# EAGLE design primero (EAGLE 9.6.2)
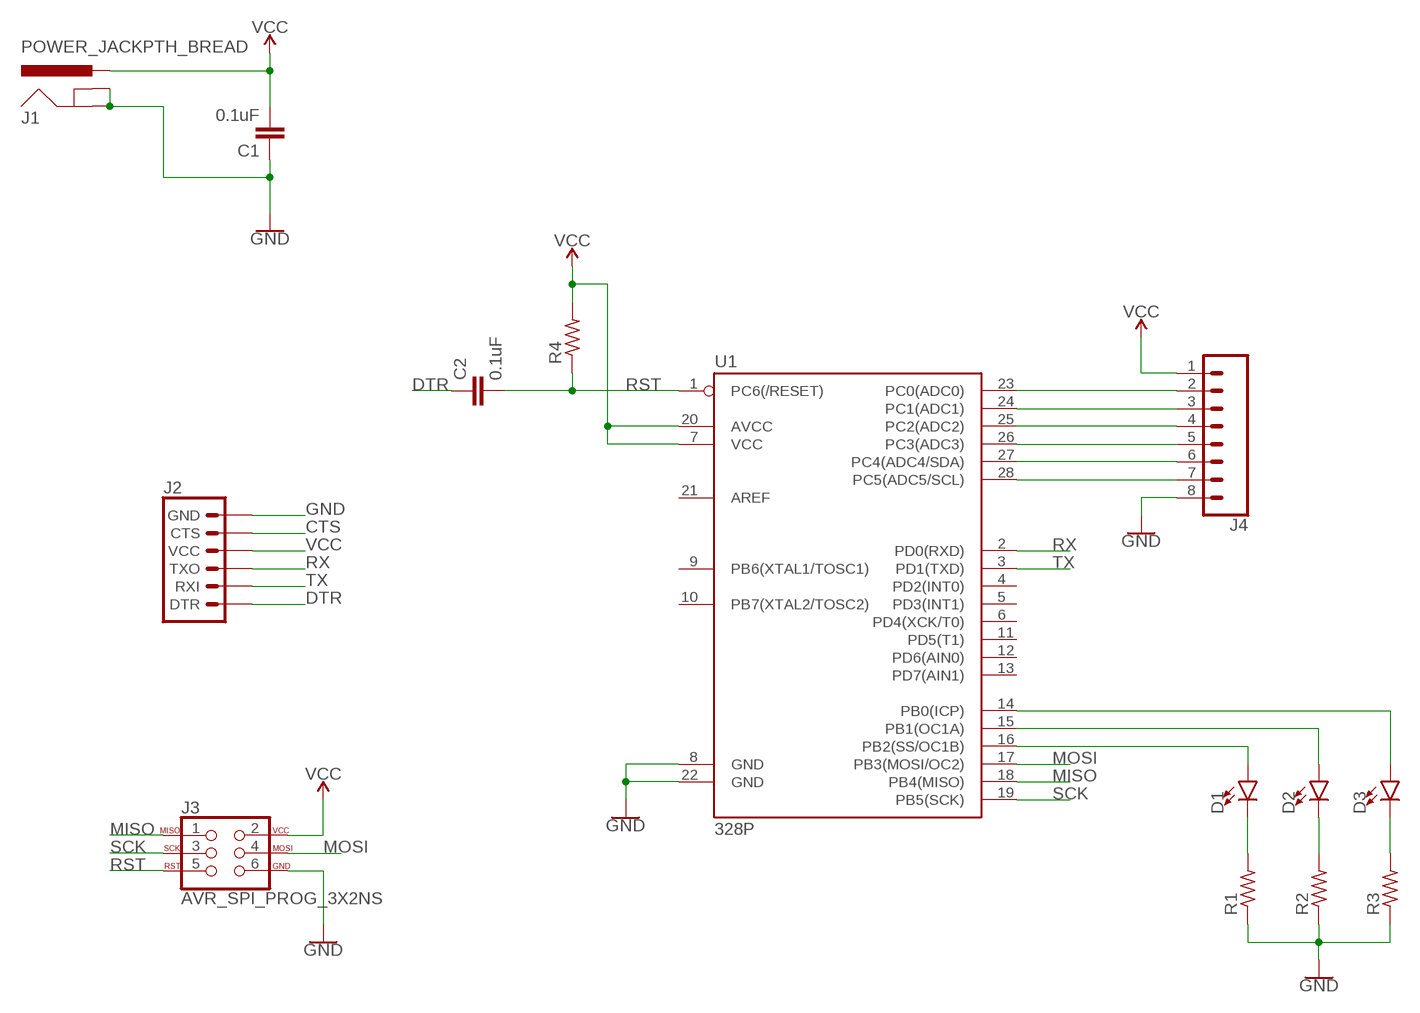
[diagram p0: schematic, sheet 1]

## Parts
C1  0.1uF  0.1UF-KIT-EZ-50V-20%  [CAP-PTH-SMALL-KIT]
C2  0.1uF  0.1UF-KIT-EZ-50V-20%  [CAP-PTH-SMALL-KIT]
D1  LED5MM  [LED_5MM]
D2  LED5MM  [LED_5MM]
D3  LED5MM  [LED_5MM]
J1  POWER_JACKPTH_BREAD  [POWER_JACK_PTH_BREAD]
J2  6_PIN_SERIAL_TARGET  [1X06]
J3  AVR_SPI_PROG_3X2NS  [2X3-NS]
J4  CONN_08"  [1X08]
R1  R-US_0204/5  [0204/5]
R2  R-US_0204/5  [0204/5]
R3  R-US_0204/5  [0204/5]
R4  R-US_0204/5  [0204/5]
U1  328P  ATMEGA328P_PDIP  [DIP28]

## Nets
CTS: J2.5(CTS)
DTR: C2.1 J2.1(DTR)
GND: C1.1 J1.GND J1.GNDBREAK J2.6(GND) J3.6 J4.8 R1.1 R2.1 R3.1 U1.8(GND) U1.22(GND)
MISO: J3.1 U1.18(PB4(MISO))
MOSI: J3.4 U1.17(PB3(MOSI/OC2))
N$2: J4.2 U1.23(PC0(ADC0))
N$3: J4.3 U1.24(PC1(ADC1))
N$4: J4.4 U1.25(PC2(ADC2))
N$5: J4.5 U1.26(PC3(ADC3))
N$6: J4.6 U1.27(PC4(ADC4/SDA))
N$7: J4.7 U1.28(PC5(ADC5/SCL))
N$8: D3.A U1.14(PB0(ICP))
N$9: D3.K(C) R3.2
N$10: D2.K(C) R2.2
N$11: D1.K(C) R1.2
N$12: D2.A U1.15(PB1(OC1A))
N$13: D1.A U1.16(PB2(SS/OC1B))
RST: C2.2 J3.5 R4.1 U1.1(PC6(/RESET))
RX: J2.3(TXO) U1.2(PD0(RXD))
SCK: J3.3 U1.19(PB5(SCK))
TX: J2.2(RXI) U1.3(PD1(TXD))
VCC: C1.2 J1.PWR J2.4(VCC) J3.2 J4.1 R4.2 U1.7(VCC) U1.20(AVCC)
Unconnected: U1.4(PD2(INT0)) U1.5(PD3(INT1)) U1.6(PD4(XCK/T0)) U1.9(PB6(XTAL1/TOSC1)) U1.10(PB7(XTAL2/TOSC2)) U1.11(PD5(T1)) U1.12(PD6(AIN0)) U1.13(PD7(AIN1)) U1.21(AREF)

## Library data of the parts
C1 C2 = SparkFun-Capacitors:0.1UF: 0.1µF ceramic capacitors A capacitor is a passive two-terminal electrical component used to store electrical energy temporarily in an electric field.; PROD_ID: CAP-08370
D1-D3 = SparkFun-LED:LED: LED (Generic) Standard schematic elements and footprints for 5mm, 3mm, 1206, and 0603 sized LEDs. Generic LEDs with no color specified.
J1 = SparkFun-Connectors:POWER_JACK: Power Jack Connector This is the standard 5.5mm barrel jack for power. The PTH is the most common, proven, reliable, footprint. The Slot footprint only works if the mill layer is transmitted to the PCB fab house so be warned. Here are the connectors we sell at SparkFun: DC Barrel Power Jack/Connector <https://www.sparkfun.com/products/119> (PRT-00119) DC Barrel Power Jack/Connector (SMD) <https://www.sparkfun.com/products/12748> (PRT-12748) DC Barrel Jack Adapter - Breadboard Compatible <https://www.sparkfun.com/products/10811> (PRT-10811) It is used on this SparkFun product (and many, many others): SparkFun RedBoard - Programmed with Arduino <https://www.sparkfun.com/products/12757> (DEV-12757) Also, if you need a mating power supply or connector, please check these out: Wall Adapter Power Supply - 9VDC 650mA <https://www.sparkfun.com/products/298> (TOL-00298) DC Barrel Jack Adapter - Male <https://www.sparkfun.com/products/10287> (PRT-10287); PROD_ID: PRT-10811
J2 = SparkFun-Connectors:6_PIN_SERIAL_TARGET: 6-pin header connection for use with the "FTDI BASIC" pinout - TARGET SIDE. Also known as "Arduino Serial Program Header". It is used to mate with our FTDI Basic serial programmers using the Arduino IDE. Note, this device has "TARGET" in the name. It is intended to be used on a design that contains a target micro-controller that you wish to program. The "sister" device, named "CABLE" is inteneded to be used on a design that usually lives on the end of your USB cable and prvides the converter chip (FTDI232 or FTDI231x) to commnicate serial RX/TX. You can populate with some of these: Break Away Headers - Straight <https://www.sparkfun.com/products/116> (PRT-00116) For reference (or to suit your programming needs) check out these designs: SparkFun FTDI Basic Breakout - 5V <https://www.sparkfun.com/products/9716> (DEV-09716) SparkFun FTDI Basic Breakout - 3.3V <https://www.sparkfun.com/products/9873> (DEV-09873) SparkFun FTDI SmartBasic <https://www.sparkfun.com/products/12935> (DEV-12935) SparkFun Beefy 3 - FTDI Basic Breakout <https://www.sparkfun.com/products/13746> (DEV-13746)
J3 = SparkFun-Connectors:AVR_SPI_PROG_3X2: AVR ISP 6 Pin This is the reduced ISP connector for AVR programming. Common on Arduino. This footprint will take up less PCB space and can be used with a 10-pin to 6-pin adapter such as SKU: BOB-08508 **Special note about "TEST_POINT" package. The stop mask is on the top side, so if you want your programming test points to be on the bottom of your board, make sure to place this package on the bottom side of the board. This also ensure that the orientation to program from the bottom side will be correct. SparkFun Products: SparkFun ISP Pogo Adapter <https://www.sparkfun.com/products/11591> - NS Tiny AVR Programmer <https://www.sparkfun.com/products/11801> -PTH
J4 = SparkFun-Connectors:CONN_08: Multi connection point. Often used as Generic Header-pin footprint for 0.1 inch spaced/style header connections On any of the 0.1 inch spaced packages, you can populate with these: Break Away Headers - Straight <https://www.sparkfun.com/products/116> (PRT-00116) Break Away Male Headers - Right Angle <https://www.sparkfun.com/products/553> (PRT-00553) Female Headers <https://www.sparkfun.com/products/115> (PRT-00115) Break Away Headers - Machine Pin <https://www.sparkfun.com/products/117> (PRT-00117) Break Away Female Headers - Swiss Machine Pin <https://www.sparkfun.com/products/743> (PRT-00743) Arduino Stackable Header - 8 Pin <https://www.sparkfun.com/products/9279> (PRT-09279) For SCREWTERMINALS and SPRING TERMINALS visit here: Screw Terimnals on SparkFun.com <https://www.sparkfun.com/search/results?term=Screw+Terminals> (5mm/3.5mm/2.54mm spacing) This device is also useful as a general connection point to wire up your design to another part of your project. Our various solder wires solder well into these plated through hole pads. Hook-Up Wire - Assortment (Stranded, 22 AWG) <https://www.sparkfun.com/products/11375> (PRT-11375) Hook-Up Wire - Assortment (Solid Core, 22 AWG) <https://www.sparkfun.com/products/11367> (PRT-11367) View the entire wire category on our website here <https://www.sparkfun.com/categories/141> Special notes: Molex polarized connector foot print use with SKU : PRT-08231 with associated crimp pins and housings. 1MM SMD Version SKU: PRT-10208 NOTES ON THE VARIANTS LOCK and LOCK_LONGPADS... This footprint was designed to help hold the alignment of a through-hole component (i.e. 6-pin header) while soldering it into place. You may notice that each hole has been shifted either up or down by 0.005 of an inch from it's more standard position (which is a perfectly straight line). This slight alteration caused the pins (the squares in the middle) to touch the edges of the holes. Because they are alternating, it causes a "brace" to hold the component in place. 0.005 has proven to be the perfect amount of "off-center" position when using our standard breakaway headers. Although looks a little odd when you look at the bare footprint, once you have a header in there, the alteration is very hard to notice. Also,if you push a header all the way into place, it is covered up entirely on the bottom side.; PROD_ID: CONN-08438
R1-R4 = rcl:R-US_: RESISTOR, American symbol; SPICEPREFIX: R
U1 = SparkFun-IC-Microcontroller:ATMEGA328P_PDIP: Atmel 328P Through hole ATMEGA328P uC used in the Arduino 32kb flash, 1k EEPROM, 2k SRAM Datasheet <http://www.sparkfun.com/datasheets/Components/SMD/ATMega328.pdf> SparkFun Products Storefront component: AVR 28 Pin 20MHz 32K 6A/D - ATMega328P <https://www.sparkfun.com/products/9061> (COM-09061) SparkFun Simon Says - Through-Hole Soldering Kit <https://www.sparkfun.com/products/10547> (KIT-10547) SparkFun Learn to Solder - Simon Says <https://www.sparkfun.com/products/13708> (KIT-13708) SparkFun BigTime Watch Kit <https://www.sparkfun.com/products/11734> (KIT-11734) SparkFun ClockIt <https://www.sparkfun.com/products/10930> (KIT-10930) SparkFun Serial Enabled LCD Kit <https://www.sparkfun.com/products/10097> (LCD-10097) SparkFun Simon Tilts - Through Hole Soldering Kit <https://www.sparkfun.com/products/12634> (KIT-12634) SparkFun Frequency Counter Kit <https://www.sparkfun.com/products/10140> (KIT-10140) FabFM Radio Kit <https://www.sparkfun.com/products/11043> (KIT-11043) SparkFun Binary Blaster Kit <https://www.sparkfun.com/products/12037> (KIT-12037) SparkFun Metro-Gnome <https://www.sparkfun.com/products/9236> (KIT-09236) ATmega328 with Arduino Optiboot (Uno) <https://www.sparkfun.com/products/10524> (DEV-10524); PROD_ID: IC-09136

## Board
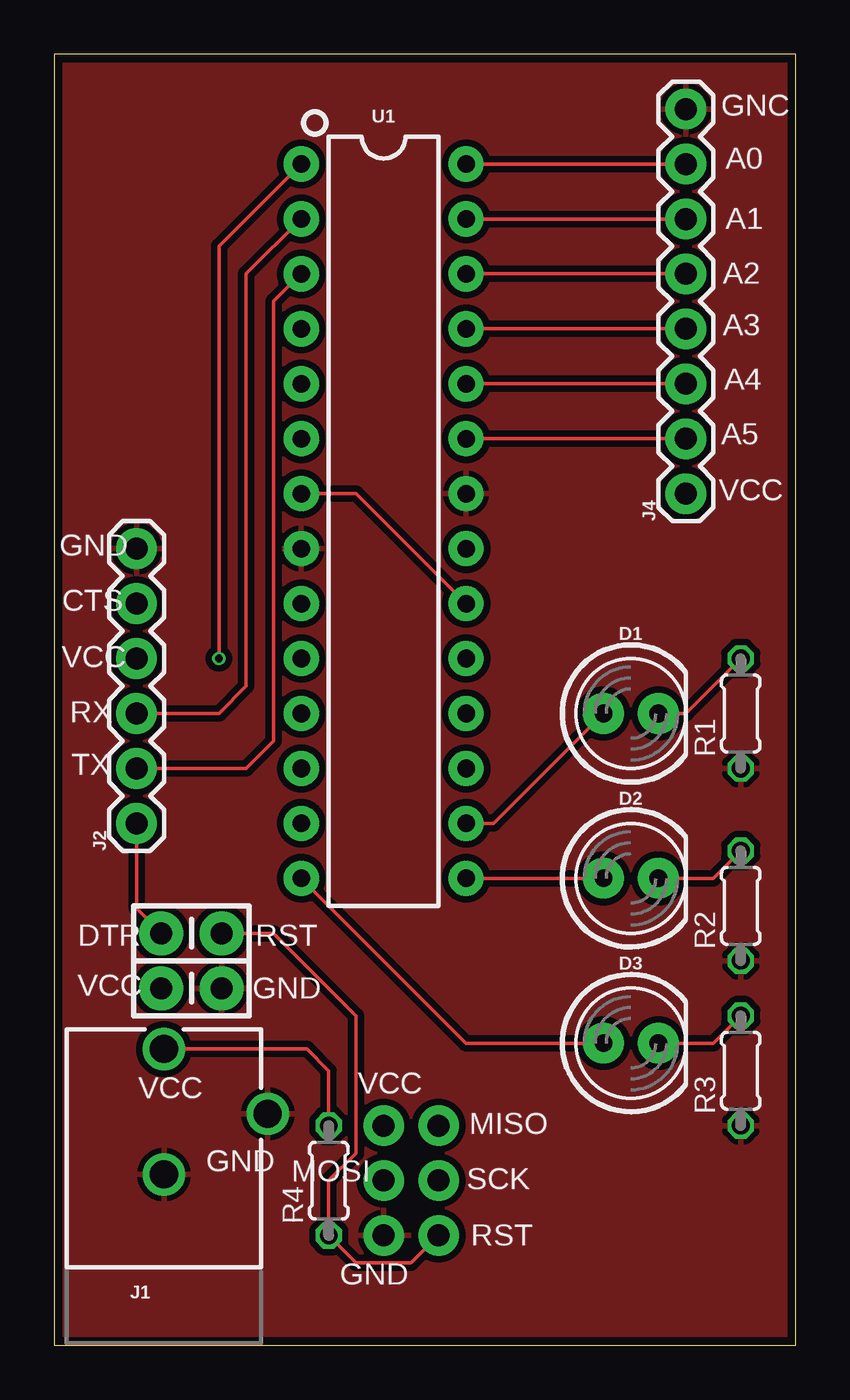
[diagram p1: board, top side]
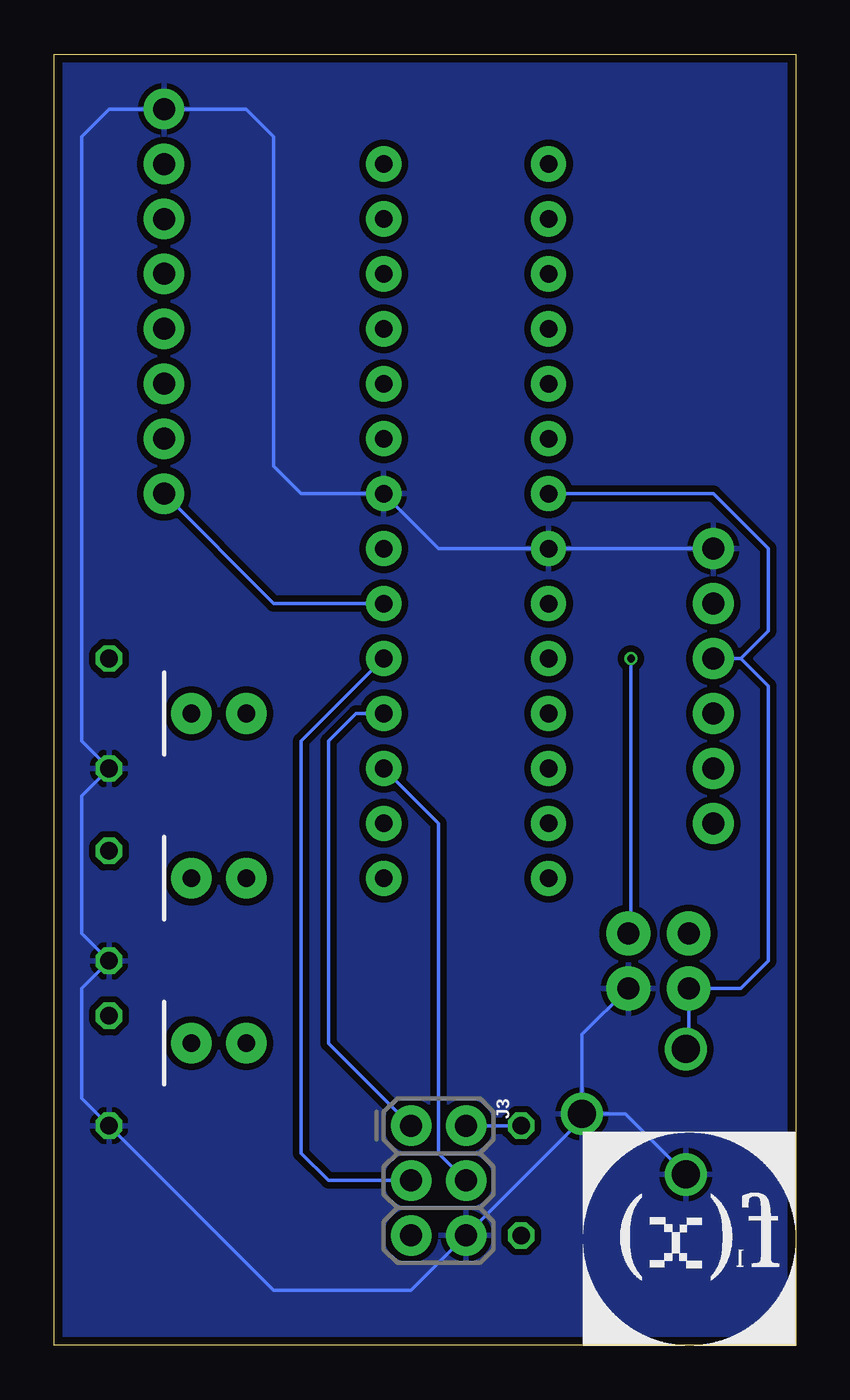
[diagram p2: board, bottom side, seen from below]

Size 34.29 x 59.69 mm. Coordinates in mm from the lower left corner, seen from the top.
Outline: 0,0 34.29,0 34.29,59.69 0,59.69 0,0
Copper layers (1*16): Top 0.035559375mm / dielectric 1.6mm / Bottom 0.035559375mm
Design rules "oshpark-2layer": minimum track width 6mil, minimum drill 10mil, track to track 6mil, track to pad 6mil, pad to pad 6mil, via to via 6mil, smd to smd 6mil, copper to edge 15mil, drill to drill 6mil, minimum pad ring 5mil, minimum via ring 5mil, stop-mask expansion 2.5mil, vias tented up to drill 0mil, thermal gap 10mil

### Footprints (pad centres in the part's own frame; a part is rotated, then mirrored left to right if it is on the bottom)
CAP-PTH-SMALL-KIT = drill 1.016 pad 2.032: 1 -1.397,0; 2 1.397,0
LED_5MM = drill 0.813 pad 1.88: A -1.27,0; K 1.27,0
POWER_JACK_PTH_BREAD = drill 1.3: GND 0,7.9; GNDBREAK 4.8,10.7; PWR 0,13.7
1X06 = drill 1.016 pad 1.88: 1 0,0; 2 2.54,0; 3 5.08,0; 4 7.62,0; 5 10.16,0; 6 12.7,0
2X3-NS = drill 1.016 pad 1.88: 1 -2.54,-1.27; 2 -2.54,1.27; 3 0,-1.27; 4 0,1.27; 5 2.54,-1.27; 6 2.54,1.27
1X08 = drill 1.016 pad 1.88: 1 0,0; 2 2.54,0; 3 5.08,0; 4 7.62,0; 5 10.16,0; 6 12.7,0; 7 15.24,0; 8 17.78,0
0204/5 = drill 0.813 octagon: 1 -2.54,0; 2 2.54,0
DIP28 = drill 0.813 pad 1.626: 1 -16.51,-3.81; 2 -13.97,-3.81; 3 -11.43,-3.81; 4 -8.89,-3.81; 5 -6.35,-3.81; 6 -3.81,-3.81; 7 -1.27,-3.81; 8 1.27,-3.81; 9 3.81,-3.81; 10 6.35,-3.81; 11 8.89,-3.81; 12 11.43,-3.81; 13 13.97,-3.81; 14 16.51,-3.81; 15 16.51,3.81; 16 13.97,3.81; 17 11.43,3.81; 18 8.89,3.81; 19 6.35,3.81; 20 3.81,3.81; 21 1.27,3.81; 22 -1.27,3.81; 23 -3.81,3.81; 24 -6.35,3.81; 25 -8.89,3.81; 26 -11.43,3.81; 27 -13.97,3.81; 28 -16.51,3.81

### Placement (x,y rotation side)
C1  6.35,16.51 180 top
C2  6.35,19.05 0 top
D1  26.67,29.21 0 top
D2  26.67,21.59 0 top
D3  26.67,13.97 0 top
J1  5.08,0 0 top
J2  3.81,24.13 90 top
J3  16.51,7.62 270 bottom
J4  29.21,39.37 90 top
R1  31.75,29.21 90 top
R2  31.75,20.32 90 top
R3  31.75,12.7 90 top
R4  12.7,7.62 90 top
U1  15.24,38.1 270 top

### Tracks (layer width: path | path; a pad name or v marks a point on that pad's centre or on a via)
DTR
  Top 0.152: C2.1 3.81,20.19 J2.1
GND
  Bottom 0.152: J1.GND 7.88,10.7 J1.GNDBREAK | C1.1 9.88,14.38 J1.GNDBREAK | J1.GNDBREAK 9.88,10.44 J3.6 17.78,2.54 24.13,2.54 R3.1 33.02,11.43 33.02,16.51 R2.1 33.02,19.05 33.02,25.4 R1.1 33.02,27.94 33.02,55.88 31.75,57.15 J4.8 25.4,57.15 24.13,55.88 24.13,40.64 22.86,39.37 U1.22 16.51,36.83 U1.8 J2.6
  pour Bottom (isolate 0.305): 0,59.69 0,0 34.29,0 34.29,59.69
  pour Top (isolate 0.305): 0,59.69 34.29,59.69 34.29,0 0,0
MISO
  Bottom 0.152: J3.1 21.59,13.97 21.59,27.94 20.32,29.21 U1.18
MOSI
  Bottom 0.152: J3.4 16.51,8.89 16.51,24.13 U1.17
N$2
  Top 0.152: J4.2 U1.23
N$3
  Top 0.152: J4.3 U1.24
N$4
  Top 0.152: J4.4 U1.25
N$5
  Top 0.152: J4.5 U1.26
N$6
  Top 0.152: J4.6 U1.27
N$7
  Top 0.152: J4.7 U1.28
N$8
  Top 0.152: D3.A 19.05,13.97 U1.14
N$9
  Top 0.152: R3.2 30.48,13.97 D3.K
N$10
  Top 0.152: R2.2 30.48,21.59 D2.K
N$11
  Top 0.152: R1.2 29.21,29.21 D1.K
N$12
  Top 0.152: D2.A U1.15
N$13
  Top 0.152: D1.A 20.32,24.13 U1.16
RST  (via drill 0.35)
  Top 0.152: J3.5 16.51,3.81 13.97,3.81 R4.1 12.7,7.62 13.97,8.89 13.97,15.24 10.16,19.05 C2.2 | U1.1 7.62,50.8 v7.62,31.75
  Bottom 0.152: C2.2 7.62,19.18 v7.62,31.75
RX
  Top 0.152: U1.2 8.89,49.53 8.89,30.48 7.62,29.21 J2.3
SCK
  Bottom 0.152: J3.3 21.59,7.62 22.86,8.89 22.86,27.94 U1.19
TX
  Top 0.152: U1.3 10.16,48.26 10.16,27.94 8.89,26.67 J2.2
VCC
  Top 0.152: J1.PWR 11.7,13.7 12.7,12.7 R4.2 | U1.7 13.97,39.37 U1.20
  Bottom 0.152: J1.PWR 4.95,13.83 C1.2 2.54,16.51 1.27,17.78 1.27,30.48 2.54,31.75 | J3.2 R4.2 | J4.1 24.13,34.29 U1.20 | 2.54,31.75 1.27,33.02 1.27,36.83 3.81,39.37 U1.7 | 2.54,31.75 J2.4

### Text on the board
tPlace: GNC | A0 | A1 | A2 | A3 | A4 | A5 | VCC | GND | CTS | VCC | RX | TX | DTR | RST | VCC | GND | VCC | VCC | MISO | GND | MOSI | SCK | RST | GND
bPlace: C:/Users/isaac/Desktop/FlatBox/logoPCB1.bmp